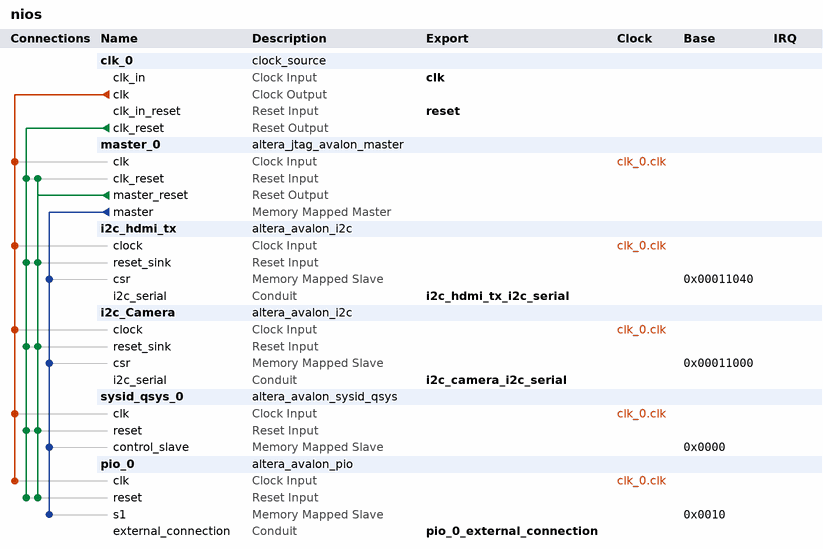
[diagram p0: system contents]
# Platform Designer (Qsys) system nios, Cyclone V 5CGXBC7D6F31C7
# Parameters at their usual value, and those the tool derives, are not listed.
package require -exact qsys 16.1
create_system nios
set_project_property DEVICE_FAMILY {Cyclone V}
set_project_property DEVICE 5CGXBC7D6F31C7

add_instance clk_0 clock_source 16.1
set_instance_parameter_value clk_0 clockFrequency 74250000

add_instance master_0 altera_jtag_avalon_master 16.1

add_instance i2c_hdmi_tx altera_avalon_i2c 16.1
set_instance_parameter_value i2c_hdmi_tx FIFO_DEPTH 32

add_instance i2c_Camera altera_avalon_i2c 16.1
set_instance_parameter_value i2c_Camera FIFO_DEPTH 32

add_instance sysid_qsys_0 altera_avalon_sysid_qsys 16.1
set_instance_parameter_value sysid_qsys_0 id 538448160

add_instance pio_0 altera_avalon_pio 16.1
set_instance_parameter_value pio_0 direction Output
set_instance_parameter_value pio_0 width 32

# connections
add_connection clk_0.clk i2c_Camera.clock clock
add_connection clk_0.clk i2c_hdmi_tx.clock clock
add_connection clk_0.clk master_0.clk clock
add_connection clk_0.clk pio_0.clk clock
add_connection clk_0.clk sysid_qsys_0.clk clock
add_connection clk_0.clk_reset i2c_Camera.reset_sink reset
add_connection clk_0.clk_reset i2c_hdmi_tx.reset_sink reset
add_connection clk_0.clk_reset master_0.clk_reset reset
add_connection clk_0.clk_reset pio_0.reset reset
add_connection clk_0.clk_reset sysid_qsys_0.reset reset
add_connection master_0.master_reset i2c_Camera.reset_sink reset
add_connection master_0.master_reset i2c_hdmi_tx.reset_sink reset
add_connection master_0.master_reset master_0.clk_reset reset
add_connection master_0.master_reset pio_0.reset reset
add_connection master_0.master_reset sysid_qsys_0.reset reset
add_connection master_0.master i2c_Camera.csr avalon
set_connection_parameter_value master_0.master/i2c_Camera.csr baseAddress 0x00011000
add_connection master_0.master i2c_hdmi_tx.csr avalon
set_connection_parameter_value master_0.master/i2c_hdmi_tx.csr baseAddress 0x00011040
add_connection master_0.master pio_0.s1 avalon
set_connection_parameter_value master_0.master/pio_0.s1 baseAddress 0x0010
add_connection master_0.master sysid_qsys_0.control_slave avalon
set_connection_parameter_value master_0.master/sysid_qsys_0.control_slave baseAddress 0x0000

# exported interfaces
add_interface clk clock sink
set_interface_property clk EXPORT_OF clk_0.clk_in
add_interface i2c_camera_i2c_serial conduit end
set_interface_property i2c_camera_i2c_serial EXPORT_OF i2c_Camera.i2c_serial
add_interface i2c_hdmi_tx_i2c_serial conduit end
set_interface_property i2c_hdmi_tx_i2c_serial EXPORT_OF i2c_hdmi_tx.i2c_serial
add_interface pio_0_external_connection conduit end
set_interface_property pio_0_external_connection EXPORT_OF pio_0.external_connection
add_interface reset reset sink
set_interface_property reset EXPORT_OF clk_0.clk_in_reset

set_interconnect_requirement {$system} qsys_mm.clockCrossingAdapter HANDSHAKE
set_interconnect_requirement {$system} qsys_mm.enableEccProtection FALSE
set_interconnect_requirement {$system} qsys_mm.insertDefaultSlave FALSE
set_interconnect_requirement {$system} qsys_mm.maxAdditionalLatency 1

save_system nios.qsys
